# EAGLE schematic nixie_clock (EAGLE 6.1)
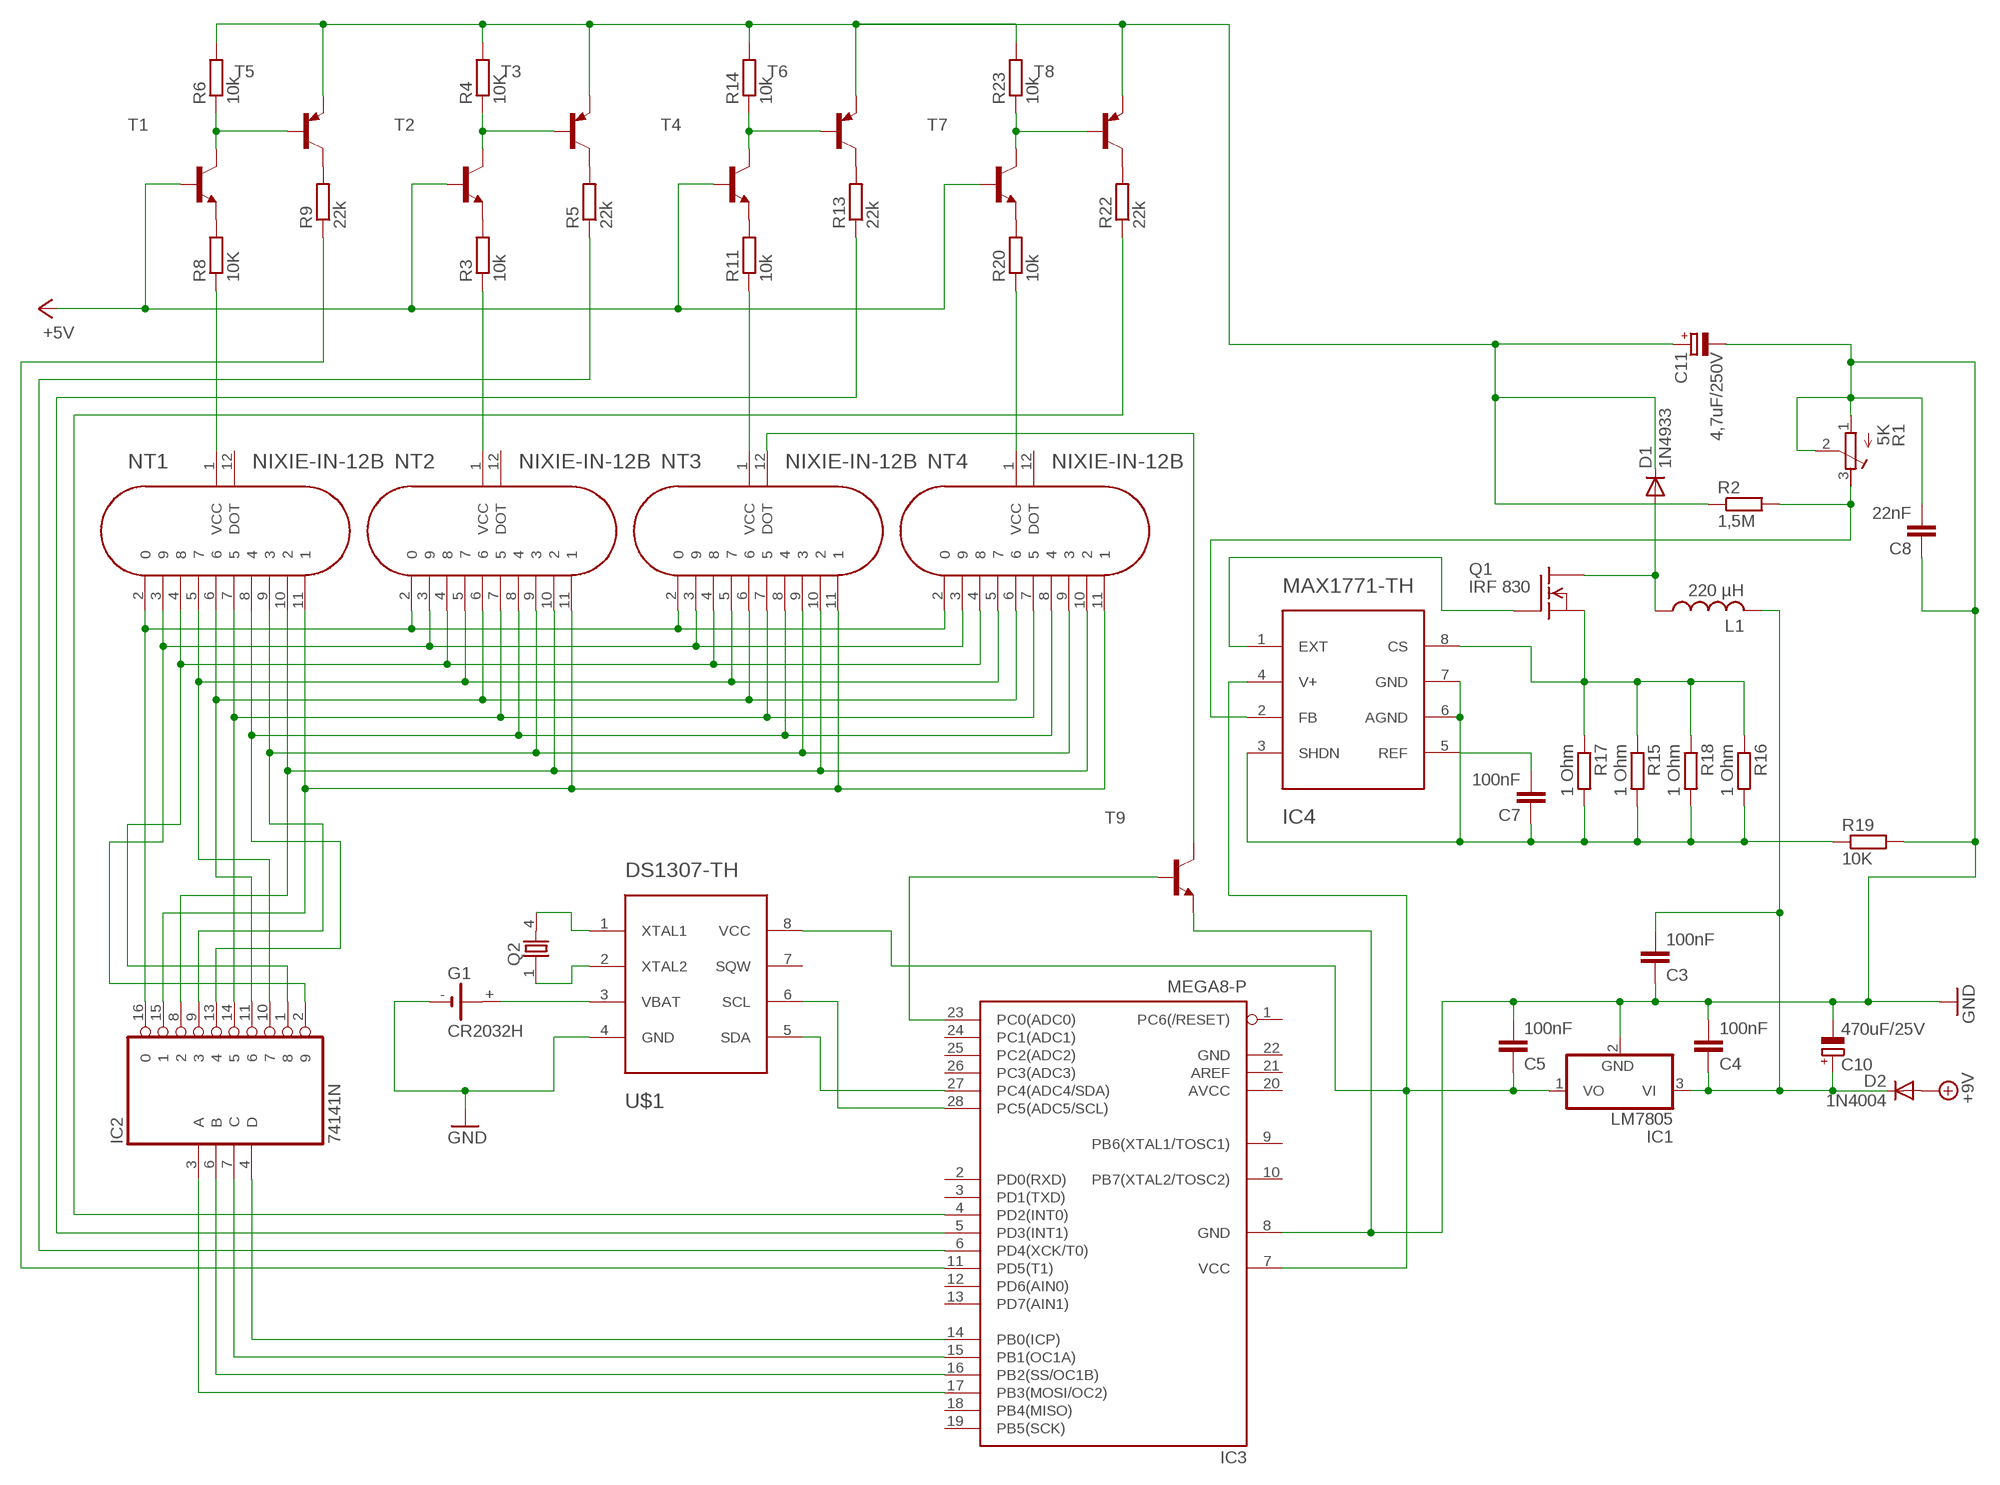
[diagram p0: schematic, sheet 1]

## Parts
C3  100nF  C5/2.5  [C5B2.5]
C4  100nF  C5/2.5  [C5B2.5]
C5  100nF  C5/2.5  [C5B2.5]
C7  100nF  C5/2.5  [C5B2.5]
C8  22nF  C5/2.5  [C5B2.5]
C10  470uF/25V  CPOL-EUE2,5-6E  [E2,5-6E]
C11  4,7uF/250V  CPOL-EUE2,5-6E  [E2,5-6E]
D1  1N4933  [DO41-10]
D2  1N4004  [DO41-10]
G1  CR2032H  [CR2032H]
IC1  LM7805  78L05Z  [TO92]
IC2  74141N  [DIL16]
IC3  MEGA8-P  [DIL28-3]
IC4  MAX1771-TH  [MAX1771]
L1  220 µH  L-USTJ4-U2  [TJ4-U2]
NT1  NIXIE-IN-12B  [NIXIE]
NT2  NIXIE-IN-12B  [NIXIE]
NT3  NIXIE-IN-12B  [NIXIE]
NT4  NIXIE-IN-12B  [NIXIE]
Q1  IRF 830  BUZ11  [TO220]
Q2  86SMX  [86SMX]
R1  5K  R-TRIMM4G/J  [RTRIM4G/J]
R2  1,5M  R-EU_0207/10  [0207/10]
R3  10k  R-EU_0207/10  [0207/10]
R4  10K  R-EU_0207/10  [0207/10]
R5  22k  R-EU_0207/10  [0207/10]
R6  10k  R-EU_0207/10  [0207/10]
R8  10K  R-EU_0207/10  [0207/10]
R9  22k  R-EU_0207/10  [0207/10]
R11  10k  R-EU_0207/10  [0207/10]
R13  22k  R-EU_0207/10  [0207/10]
R14  10k  R-EU_0207/10  [0207/10]
R15  1 Ohm  R-EU_0207/10  [0207/10]
R16  1 Ohm  R-EU_0207/10  [0207/10]
R17  1 Ohm  R-EU_0207/10  [0207/10]
R18  1 Ohm  R-EU_0207/10  [0207/10]
R19  10K  R-EU_0207/10  [0207/10]
R20  10k  R-EU_0207/10  [0207/10]
R22  22k  R-EU_0207/10  [0207/10]
R23  10k  R-EU_0207/10  [0207/10]
T1  MPSA44-NPN-TO92-CBE  [TO92-CBE]
T2  MPSA44-NPN-TO92-CBE  [TO92-CBE]
T3  MPSA64-PNP-TO92-CBE  [TO92-CBE]
T4  MPSA44-NPN-TO92-CBE  [TO92-CBE]
T5  MPSA64-PNP-TO92-CBE  [TO92-CBE]
T6  MPSA64-PNP-TO92-CBE  [TO92-CBE]
T7  MPSA44-NPN-TO92-CBE  [TO92-CBE]
T8  MPSA64-PNP-TO92-CBE  [TO92-CBE]
T9  MPSA44-NPN-TO92-CBE  [TO92-CBE]
U$1  DS1307-TH  [DS1307]

## Nets
+5V: T1.B T2.B T4.B T7.B
+9V: D2.A
GND: C3.1 C4.2 C5.2 C8.1 C8.2 C10.- C11.- G1.- IC1.2(GND) IC3.8(GND) R1.1(E) R1.2(S) R19.2 T9.E U$1.4(GND)
IC5: Q2.1 U$1.2(XTAL2)
MAX1771: IC4.1(EXT) Q1.1(G)
N$1: R6.1 T1.C T5.B
N$2: R4.1 T2.C T3.B
N$3: R9.2 T5.C
N$4: IC4.2(FB) R1.3(A) R2.2
N$5: R14.1 T4.C T6.B
N$6: R5.2 T3.C
N$7: R23.1 T7.C T8.B
N$8: R13.2 T6.C
N$9: R22.2 T8.C
N$10: R8.2 T1.E
N$11: R3.2 T2.E
N$12: R11.2 T4.E
N$13: R20.2 T7.E
N$14: IC2.16 NT1.2 NT2.2 NT3.2 NT4.2
N$15: C11.+ D1.C R2.1 T8.E
N$16: IC2.8 NT1.10 NT2.10 NT3.10 NT4.10
N$17: IC2.9 NT1.9 NT2.9 NT3.9 NT4.9
N$18: IC2.13 NT1.8 NT2.8 NT3.8 NT4.8
N$20: NT2.1(VCC) R3.1
N$21: NT3.1(VCC) R11.1
N$22: NT4.1(VCC) R20.1
N$23: IC3.11(PD5(T1)) R9.1
N$24: D1.A L1.1 Q1.2(D)
N$25: C5.1 IC1.1(VO) IC3.7(VCC) IC4.4(V+) U$1.8(VCC)
N$26: IC4.8(CS) Q1.3(S) R15.1 R16.1 R17.1 R18.1
N$27: IC3.6(PD4(XCK/T0)) R5.1
N$28: IC3.5(PD3(INT1)) R13.1
N$29: C7.2 IC4.5(REF)
N$30: C3.2 C4.1 C10.+ D2.C IC1.3(VI) L1.2
N$31: IC3.4(PD2(INT0)) R22.1
N$32: IC2.14 NT1.7 NT2.7 NT3.7 NT4.7
N$33: IC2.11 NT1.6 NT2.6 NT3.6 NT4.6
N$34: IC2.10 NT1.5 NT2.5 NT3.5 NT4.5
N$35: IC2.1 NT1.4 NT2.4 NT3.4 NT4.4
N$36: IC2.2 NT1.3 NT2.3 NT3.3 NT4.3
N$37: IC2.4(D) IC3.14(PB0(ICP))
N$38: IC2.7(C) IC3.15(PB1(OC1A))
N$39: IC2.6(B) IC3.16(PB2(SS/OC1B))
N$40: IC2.3(A) IC3.17(PB3(MOSI/OC2))
N$41: IC3.27(PC4(ADC4/SDA)) U$1.5(SDA)
N$42: IC3.28(PC5(ADC5/SCL)) U$1.6(SCL)
N$43: IC2.15 NT1.11 NT2.11 NT3.11 NT4.11
N$44: R4.2 R6.2 R14.2 R23.2 T3.E T5.E T6.E
N$45: Q2.4 U$1.1(XTAL1)
N$46: C7.1 IC4.3(SHDN) IC4.6(AGND) IC4.7(GND) R15.2 R16.2 R17.2 R18.2 R19.1
N$47: G1.+ U$1.3(VBAT)
N$48: NT3.12(DOT) T9.C
N$51: IC3.23(PC0(ADC0)) T9.B
NT1: NT1.1(VCC) R8.1
Unconnected: G1.+@1(+) IC3.1(PC6(/RESET)) IC3.2(PD0(RXD)) IC3.3(PD1(TXD)) IC3.9(PB6(XTAL1/TOSC1)) IC3.10(PB7(XTAL2/TOSC2)) IC3.12(PD6(AIN0)) IC3.13(PD7(AIN1)) IC3.18(PB4(MISO)) IC3.19(PB5(SCK)) IC3.21(AREF) IC3.24(PC1(ADC1)) IC3.25(PC2(ADC2)) IC3.26(PC3(ADC3)) NT1.12(DOT) NT2.12(DOT) NT4.12(DOT) U$1.7(SQW)

## Power pins joined to a net without a drawn wire
AVCC: IC3.20(AVCC)
GND: IC2.12(GND) IC3.22(GND)
VCC: IC2.5(VCC)

## Library data of the parts
C3-C5 C7 C8 = capacitor-wima:C: CAPACITOR naming: grid - package width
C10 C11 = rcl:CPOL-EU: POLARIZED CAPACITOR, European symbol
D1 = diode:1N4933: DIODE fast recovery rectifier, 1A
D2 = diode:1N4004: DIODE general purpose rectifier, 1 A
G1 = battery:CR2032H: LI BATTERY Varta
IC1 = linear:78*: Positive VOLTAGE REGULATOR Source: http://cache.national.com/ds/LM/LM78L05.pdf http://www.fairchildsemi.com/ds/LM/LM7805.pdf
IC2 = 74xx-eu:74*141: BCD to decimal DECODER/DRIVER
IC3 = atmel:MEGA8-P: MICROCONTROLLER 8 Kbytes FLASH, 1 kbytes SRAM, 512 bytes EEPROM, USART, 4-channel 10 bit ADC, 2-channel 8 bit ADC Pin compatible with Atmega48, ATMega88, ATMega168 Source: avr.lbr; OC_FARNELL: unknown; OC_NEWARK: unknown
IC4 = max1771:MAX1771: MAX1771
L1 = resistor:L-US: INDUCTOR, American symbol
NT1-NT4 = nixie:NIXIE: NIXIE
Q1 = transistor-fet:BUZ11: N-Channel Enhancement MOSFET 50V; 30A; 0,040Ohm
Q2 = crystal:86SMX: CRYSTAL; MF: C-MAC FREQUENCY PRODUCTS LTD; MPN: XTAL003321- 86SMX; OC_FARNELL: 6344914; OC_NEWARK: 01H9866
R1 = rcl:R-TRIMM: Trimm resistor
R2-R6 R8 R9 R11 R13-R20 R22 R23 = resistor:R-EU_: RESISTOR, European symbol
T1 T2 T4 T7 T9 = transistor:*-NPN-: NPN Transistror BF959 corrected 2008.03.06
T3 T5 T6 T8 = transistor:*-PNP-: PNP Transistror
U$1 = ds1307:DS1307